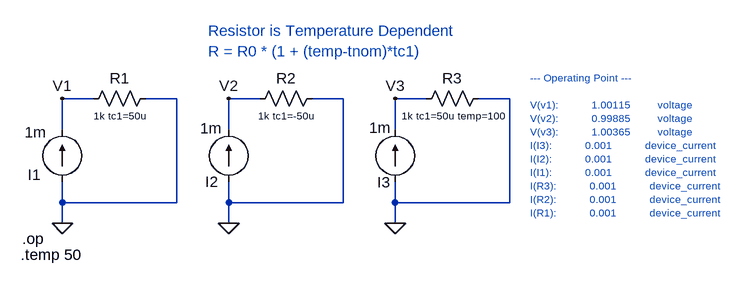
[diagram p0: schematic DC Op.asc]
DC Op.asc, the LTspice schematic file:
Version 4
SHEET 1 1096 680
WIRE 112 80 64 80
WIRE 240 80 192 80
WIRE 368 80 320 80
WIRE 496 80 448 80
WIRE 624 80 576 80
WIRE 752 80 704 80
WIRE 64 128 64 80
WIRE 320 128 320 80
WIRE 576 128 576 80
WIRE 64 240 64 208
WIRE 240 240 240 80
WIRE 240 240 64 240
WIRE 320 240 320 208
WIRE 496 240 496 80
WIRE 496 240 320 240
WIRE 576 240 576 208
WIRE 752 240 752 80
WIRE 752 240 576 240
WIRE 64 272 64 240
WIRE 320 272 320 240
WIRE 576 272 576 240
FLAG 64 272 0
FLAG 64 80 V1
FLAG 320 272 0
FLAG 320 80 V2
FLAG 576 272 0
FLAG 576 80 V3
SYMBOL current 64 208 R180
WINDOW 0 33 11 Left 2
WINDOW 3 24 76 Left 2
WINDOW 123 0 0 Left 0
WINDOW 39 0 0 Left 0
SYMATTR InstName I1
SYMATTR Value 1m
SYMBOL res 96 96 R270
WINDOW 0 32 56 VTop 2
WINDOW 3 0 56 VBottom 1
SYMATTR InstName R1
SYMATTR Value 1k tc1=50u
SYMBOL current 320 208 R180
WINDOW 0 16 0 Left 2
WINDOW 3 10 82 Left 2
WINDOW 123 0 0 Left 0
WINDOW 39 0 0 Left 0
SYMATTR InstName I2
SYMATTR Value 1m
SYMBOL res 352 96 R270
WINDOW 0 32 56 VTop 2
WINDOW 3 0 56 VBottom 1
SYMATTR InstName R2
SYMATTR Value 1k tc1=-50u
SYMBOL current 576 208 R180
WINDOW 0 7 -1 Left 2
WINDOW 3 6 83 Left 2
WINDOW 123 0 0 Left 0
WINDOW 39 0 0 Left 0
SYMATTR InstName I3
SYMATTR Value 1m
SYMBOL res 608 96 R270
WINDOW 0 32 56 VTop 2
WINDOW 3 0 56 VBottom 1
SYMATTR InstName R3
SYMATTR Value 1k tc1=50u temp=100
TEXT 2 296 Left 2 !.op
TEXT 0 320 Left 2 !.temp 50
TEXT 784 48 Left 1 ;--- Operating Point ---\n \nV(v1):           1.00115         voltage\nV(v2):           0.99885         voltage\nV(v3):           1.00365         voltage\nI(I3):           0.001           device_current\nI(I2):           0.001           device_current\nI(I1):           0.001           device_current\nI(R3):           0.001           device_current\nI(R2):           0.001           device_current\nI(R1):           0.001           device_current
TEXT 288 -24 Left 2 ;Resistor is Temperature Dependent\nR = R0 * (1 + (temp-tnom)*tc1)

The netlist it stands for:
* DC Op.asc
I1 0 V1 1m
R1 V1 0 1k tc1=50u
I2 0 V2 1m
R2 V2 0 1k tc1=-50u
I3 0 V3 1m
R3 V3 0 1k tc1=50u temp=100
.op
.temp 50
* --- Operating Point ---
* V(v1):           1.00115         voltage
* V(v2):           0.99885         voltage
* V(v3):           1.00365         voltage
* I(I3):           0.001           device_current
* I(I2):           0.001           device_current
* I(I1):           0.001           device_current
* I(R3):           0.001           device_current
* I(R2):           0.001           device_current
* I(R1):           0.001           device_current
* Resistor is Temperature Dependent
* R = R0 * (1 + (temp-tnom)*tc1)
.backanno
.end